# EAGLE design 02_battery_powered_v0001 (EAGLE 6.4)
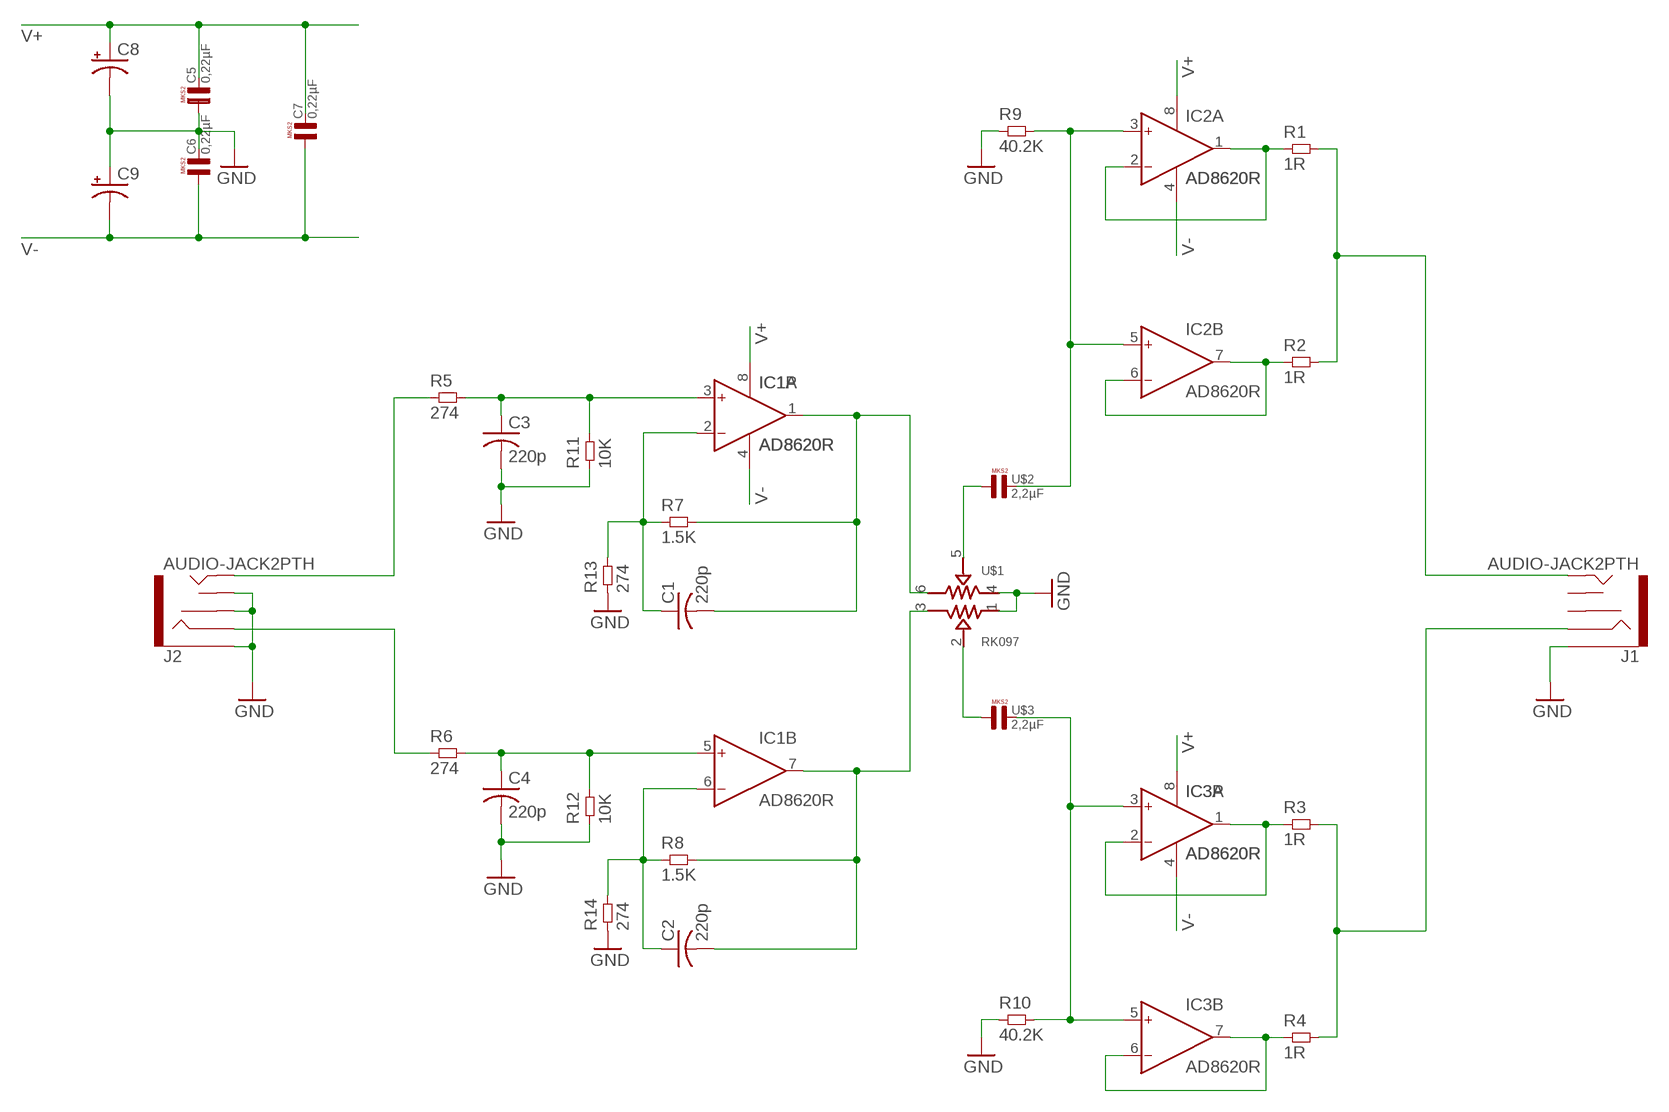
[diagram p0: schematic, sheet 1]

## Parts
C1  220p  C-US025-050X050  [C025-050X050]
C2  220p  C-US025-050X050  [C025-050X050]
C3  220p  C-US025-050X050  [C025-050X050]
C4  220p  C-US025-050X050  [C025-050X050]
C5  0,22µF  [R5B3]
C6  0,22µF  [R5B3]
C7  0,22µF  [R5B3]
C8  CPOL-US150CLZ-1010  [150CLZ-1010]
C9  CPOL-US150CLZ-1010  [150CLZ-1010]
IC1  AD8620R  [SO8]
IC2  AD8620R  [SO8]
IC3  AD8620R  [SO8]
J1  AUDIO-JACK2PTH  [AUDIO-JACK]
J2  AUDIO-JACK2PTH  [AUDIO-JACK]
R1  1R  RES1206L3  [1206L3]
R2  1R  RES1206L3  [1206L3]
R3  1R  RES1206L3  [1206L3]
R4  1R  RES1206L3  [1206L3]
R5  274  RES0603L3  [0603L3]
R6  274  RES0603L3  [0603L3]
R7  1.5K  RES0603L3  [0603L3]
R8  1.5K  RES0603L3  [0603L3]
R9  40.2K  RES0603L3  [0603L3]
R10  40.2K  RES0603L3  [0603L3]
R11  10K  RES0603L3  [0603L3]
R12  10K  RES0603L3  [0603L3]
R13  274  RES0603L3  [0603L3]
R14  274  RES0603L3  [0603L3]
U$1  RK097  [RK097]
U$2  2,2µF  [R5B7K2]
U$3  2,2µF  [R5B7K2]

## Nets
GND: C3.2 C4.2 C5.1 C6.2 C8.- C9.+ J1.SLEEVE J2.RSH J2.SLEEVE J2.TSH R9.P$1 R10.P$1 R11.P$1 R12.P$1 R13.P$1 R14.P$1 U$1.1 U$1.4
N$1: IC2.1(A:OUT) IC2.2(A:IN-) R1.1
N$2: IC2.6(B:IN-) IC2.7(B:OUT) R2.1
N$3: J1.TIP R1.2 R2.2
N$4: IC3.1(A:OUT) IC3.2(A:IN-) R3.1
N$5: IC3.6(B:IN-) IC3.7(B:OUT) R4.1
N$6: J1.RING R3.2 R4.2
N$7: C3.1 IC1.3(A:IN+) R5.P$2 R11.P$2
N$8: C4.1 IC1.5(B:IN+) R6.P$2 R12.P$2
N$9: C1.2 IC1.1(A:OUT) R7.P$2 U$1.6
N$10: C2.2 IC1.7(B:OUT) R8.P$2 U$1.3
N$11: C1.1 IC1.2(A:IN-) R7.P$1 R13.P$2
N$12: C2.1 IC1.6(B:IN-) R8.P$1 R14.P$2
N$13: U$1.5 U$2.1
N$14: U$1.2 U$3.1
N$15: IC2.3(A:IN+) IC2.5(B:IN+) R9.P$2 U$2.2
N$16: IC3.3(A:IN+) IC3.5(B:IN+) R10.P$2 U$3.2
N$18: J2.TIP R5.P$1
N$19: J2.RING R6.P$1
V+: C5.2 C7.2 C8.+ IC1.8(P:V+) IC2.8(P:V+) IC3.8(P:V+)
V-: C6.1 C7.1 C9.- IC1.4(P:V-) IC2.4(P:V-) IC3.4(P:V-)
Unconnected: J1.RSH J1.TSH

## Library data of the parts
C1-C4 = rcl:C-US: CAPACITOR, American symbol
C5-C7 = Capacitor-Wima-MKS2-63v:0,22µF
C8 C9 = rcl:CPOL-US: POLARIZED CAPACITOR, American symbol
IC1-IC3 = analog-devices:AD8620: Precision, Very Low Noise, Low Input Bias Current, Wide Bandwidth JFET Operational Amplifiers Source: http://www.analog.com/static/imported-files/data_sheets/AD8610_8620.pdf; MF: ALTERA CORPORATION; MPN: AD8620ARZ; OC_FARNELL: 9994386; OC_NEWARK: 59K6972
J1 J2 = SparkFun-Connectors:AUDIO-JACK2: Stereo audio jack with bypass switches. Used on LilyPad MP3 board. Production SKU: CONN-10353
R1-R14 = common:RES
U$1 = SparkFun-Electromechanical:RK097
U$2 U$3 = Capacitor-Wima-MKS2-63v:2,2µF

## Board
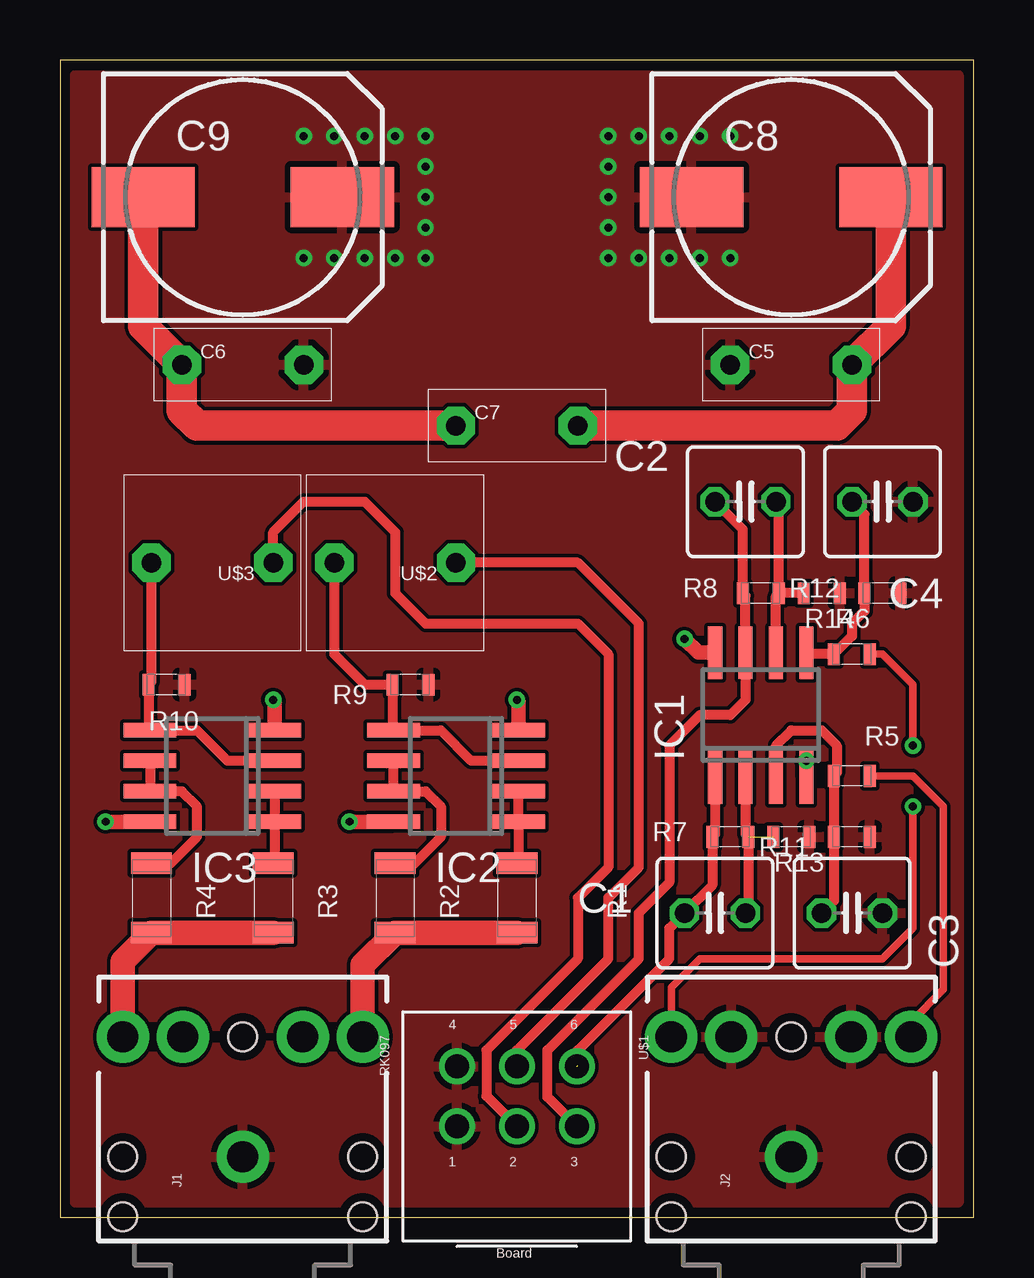
[diagram p1: board, top side]
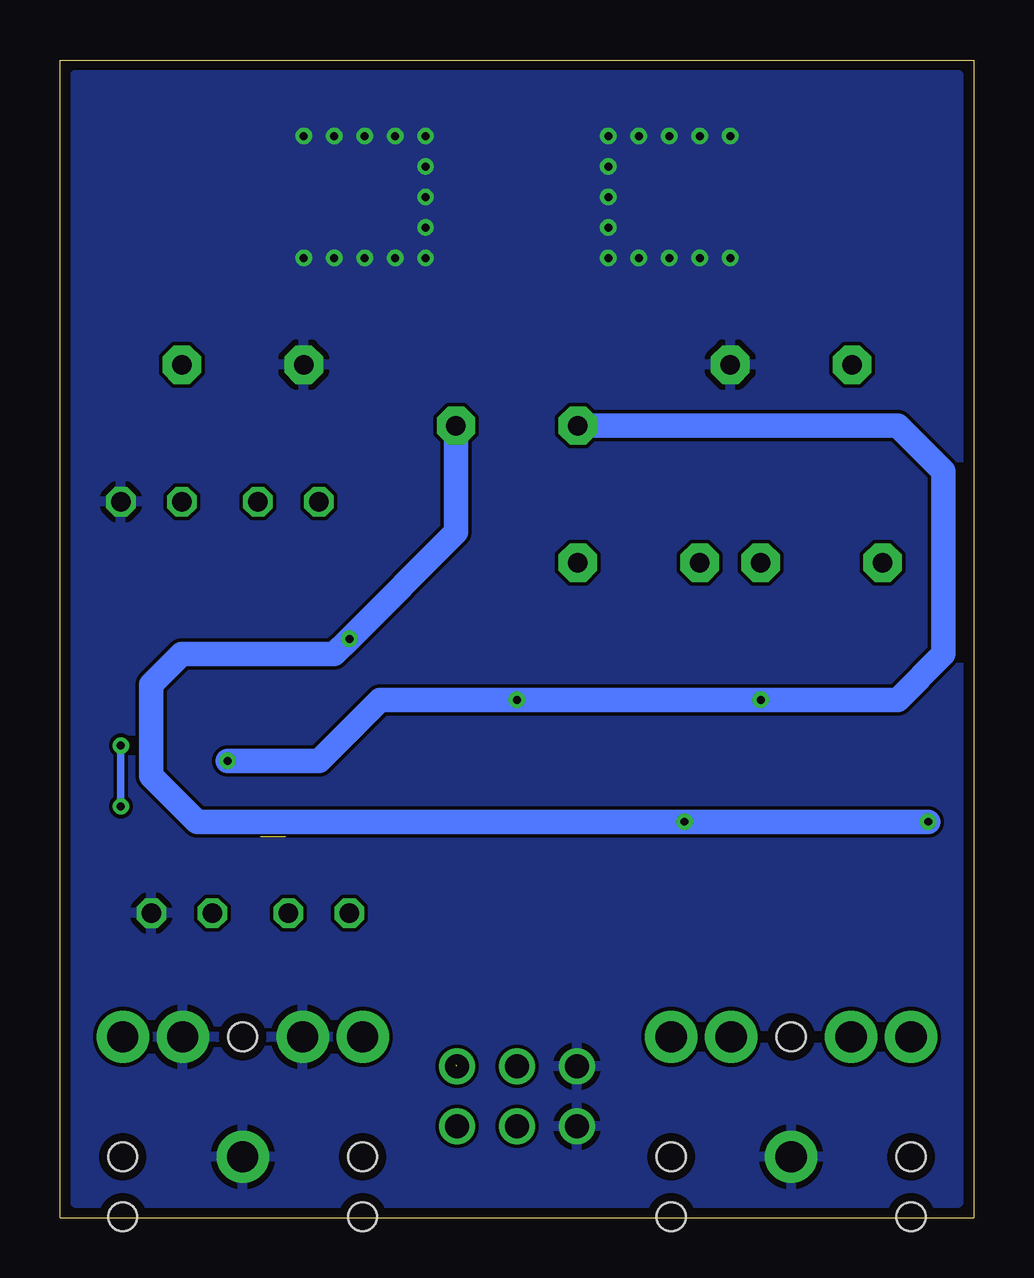
[diagram p2: board, bottom side, seen from below]

Size 38.1 x 48.26 mm. Coordinates in mm from the lower left corner, seen from the top.
Outline: 0,48.26 0,0 38.1,0 38.1,48.26 0,48.26
Copper layers (1*16): Top 0.035mm / dielectric 1.5mm / Bottom 0.035mm
Design rules "osh_2_layer": minimum track width 5mil, minimum drill 13mil, track to track 6mil, track to pad 6mil, pad to pad 6mil, via to via 6mil, smd to smd 6mil, copper to edge 15mil, drill to drill 8mil, minimum pad ring 7mil, minimum via ring 7mil, stop-mask expansion 4mil, vias tented up to drill 16mil, thermal gap 10mil

### Footprints (pad centres in the part's own frame; a part is rotated, then mirrored left to right if it is on the bottom)
C025-050X050 = drill 0.813 octagon: 1 -1.27,0; 2 1.27,0
R5B3 = drill 0.813 pad 1.6 octagon: 1 -2.54,0; 2 2.54,0
150CLZ-1010 = smd 4.3 x 2.5: + 4.15,0; - -4.15,0
SO8 = smd 0.6 x 2.2: 1 -1.905,-2.6; 2 -0.635,-2.6; 3 0.635,-2.6; 4 1.905,-2.6; 5 1.905,2.6; 6 0.635,2.6; 7 -0.635,2.6; 8 -1.905,2.6
AUDIO-JACK = drill 1.3 pad 2.184: RING 5,5; RSH 5,2.5; SLEEVE 0,0; TIP 5,-5; TSH 5,-2.5 | hole 1.2: 0,5; -2.5,5; -2.5,-5; 0,-5; 5,0
1206L3 = smd 0.9 x 1.7: 1 -1.45,0; 2 1.45,0
0603L3 = smd 0.5 x 0.9: P$1 -0.75,0; P$2 0.75,0
RK097 = drill 1: 1 2.5,0; 2 0,0; 3 -2.5,0; 4 2.5,-2.5; 5 0,-2.5; 6 -2.5,-2.5
R5B7K2 = drill 0.813 pad 1.6 octagon: 1 -2.54,0; 2 2.54,0

### Placement (x,y rotation side)
C1  27.3,12.7 180 top
C2  28.58,29.85 180 top
C3  33.02,12.7 0 top
C4  34.29,29.85 0 top
C5  30.48,35.56 0 top
C6  7.62,35.56 0 top
C7  19.05,33.02 0 top
C8  30.48,42.55 0 top
C9  7.62,42.55 0 top
IC1  29.21,20.96 0 top
IC2  16.51,18.42 90 top
IC3  6.35,18.42 90 top
J1  7.62,2.54 90 top
J2  30.48,2.54 90 top
R1  19.05,13.34 270 top
R2  13.97,13.34 270 top
R3  8.89,13.34 270 top
R4  3.81,13.34 270 top
R5  33.02,18.42 180 top
R6  33.02,23.5 180 top
R7  27.94,15.88 180 top
R8  29.21,26.04 180 top
R9  14.61,22.22 180 top
R10  4.45,22.22 180 top
R11  33.02,15.88 180 top
R12  34.29,26.04 180 top
R13  30.48,15.88 180 top
R14  31.75,26.04 180 top
U$1  19.05,3.81 180 top
U$2  13.97,27.3 180 top
U$3  6.35,27.3 180 top

### Tracks (layer width: path | path; a pad name or v marks a point on that pad's centre or on a via)
GND  (via drill 0.33)
  other vias: 10.16,40 11.43,40 12.7,40 13.97,40 15.24,40 15.24,41.28 15.24,42.55 15.24,43.81 15.24,45.08 13.97,45.08 12.7,45.08 11.43,45.08 10.16,45.08 22.86,40 24.13,40 25.4,40 26.67,40 27.94,40 22.86,41.28 22.86,42.55 22.86,43.81 22.86,45.08 24.13,45.08 25.4,45.08 26.67,45.08 27.94,45.08
  pour Top: 0.64,47.62 37.46,47.62 37.46,0.63 0.64,0.63
  pour Bottom: 0.64,47.62 37.46,47.62 37.46,0.63 0.64,0.63
N$1
  Top 0.406: R1.1 19.05,14.61 19.11,14.66 IC2.1 IC2.2
N$2
  Top 0.406: R2.1 14.15,14.61 14.61,14.61 15.88,15.88 15.88,17.14 15.24,17.78 IC2.7 IC2.6
N$3
  Top 1.016: J1.TIP 12.62,10.54 R2.2 R1.2
N$4
  Top 0.406: IC3.2 IC3.1 8.95,14.84 R3.1
N$5
  Top 0.406: R4.1 4.62,14.79 5.72,15.88 5.72,17.14 5.08,17.78 IC3.7 IC3.6
N$6
  Top 1.016: J1.RING 2.62,10.7 R4.2 R3.2
N$7
  Top 0.406: IC1.3 29.85,19.68 30.48,20.32 31.75,20.32 32.39,19.68 32.39,18.53 R5.P$2 R11.P$2 32.27,13.22 C3.1
N$8
  Top 0.406: C4.1 33.54,29.32 R12.P$2 33.54,25.29 33.02,24.76 33.02,24.25 R6.P$2 31.17,23.5 IC1.5
N$9  (1 unrouted)
  Top 0.406: IC1.1 27.3,15.99 R7.P$2 27.19,13.86 C1.2 25.4,12.07 25.4,10.79 21.59,6.98 21.59,6.35
N$10
  Top 0.406: C2.2 28.46,28.69 R8.P$2 28.58,25.92 IC1.7 28.58,21.59 27.94,20.96 26.67,20.96 25.4,19.68 25.4,13.97 24.13,12.7 24.13,10.79 20.32,6.98 20.32,5.04 U$1.3
N$11  (1 unrouted)
  Top 0.406: IC1.2 28.58,15.99 R7.P$1 28.69,12.82 C1.1
N$12
  Top 0.406: IC1.6 29.85,25.92 R8.P$1 | R14.P$2 R8.P$1 | R8.P$1 29.96,29.73 C2.1
N$13
  Top 0.406: U$1.5 19.05,6.98 22.86,10.79 22.86,13.34 24.13,14.61 24.13,24.76 21.59,27.3 U$2.1
N$14
  Top 0.406: U$3.1 8.89,28.57 10.16,29.85 12.7,29.85 13.97,28.57 13.97,26.04 15.24,24.76 21.59,24.76 22.86,23.5 22.86,14.61 21.59,13.34 21.59,10.79 17.78,6.98 17.78,5.08 U$1.2
N$15
  Top 0.406: IC2.3 17.14,19.05 15.88,20.32 IC2.5 13.86,20.37 R9.P$2 12.7,22.22 11.43,23.5 U$2.2
N$16
  Top 0.406: IC3.3 6.98,19.05 5.72,20.32 IC3.5 3.7,20.37 R10.P$2 3.81,22.34 U$3.2
N$18
  Top 0.305: J2.TIP 35.48,8.18 36.83,9.52 36.83,17.14 35.56,18.42 R5.P$1
N$19  (via drill 0.33)
  Top 0.305: J2.RING 25.48,9.61 26.67,10.79 34.29,10.79 35.56,12.07 v35.56,17.14 | v35.56,19.68 35.56,22.22 34.29,23.5 R6.P$1
  Bottom 0.305: v35.56,17.14 v35.56,19.68
V+  (via drill 0.33)
  Top 0.61: IC3.8 v1.91,16.51 | IC1.8 26.61,23.55 v26.04,24.13 | v12.07,16.51 IC2.8
  Top 1.27: C8.+ 34.63,37.17 C5.2 33.02,33.66 32.39,33.02 C7.2
  Bottom 1.016: v1.91,16.51 v12.07,16.51 32.39,16.51 34.29,18.42 34.29,22.22 33.02,23.5 26.67,23.5 v26.04,24.13 21.59,28.57 C7.2
V-  (via drill 0.33)
  Top 0.61: IC1.4 v31.11,19.05 | IC3.4 8.95,21.53 v8.89,21.59 | IC2.4 19.11,21.53 v19.05,21.59
  Top 1.27: C9.- 3.47,37.17 C6.1 5.08,33.66 5.72,33.02 C7.1
  Bottom 1.016: v31.11,19.05 27.3,19.05 24.77,21.59 v19.05,21.59 v8.89,21.59 3.17,21.59 1.27,23.5 1.27,31.11 3.17,33.02 C7.1